# Altium schematic sheet STM32_microcontroller_IOs.SchDoc: STM32_microcontroller_IOs
size A3; Date: Not used; ApprovedBy: Not used; CheckedBy: Not used; Author: Not used; CompanyName: STMicroelectronics; DrawnBy: Not used; Engineer: Not used; Organization: Not used; Address1: Not used; Address2: Not used; Address3: Not used; Address4: Not used; DocumentNumber: 3; Revision: Not used; SheetNumber: 3; SheetTotal: 9; CurrentTime: Not used; CurrentDate: Not used; Time: Not used; DocumentFullPathAndName: Not used; DocumentName: Not used; ModifiedDate: Not used; ImagePath: Not used; ProjectName: Not used; Application_BuildNumber: Not used
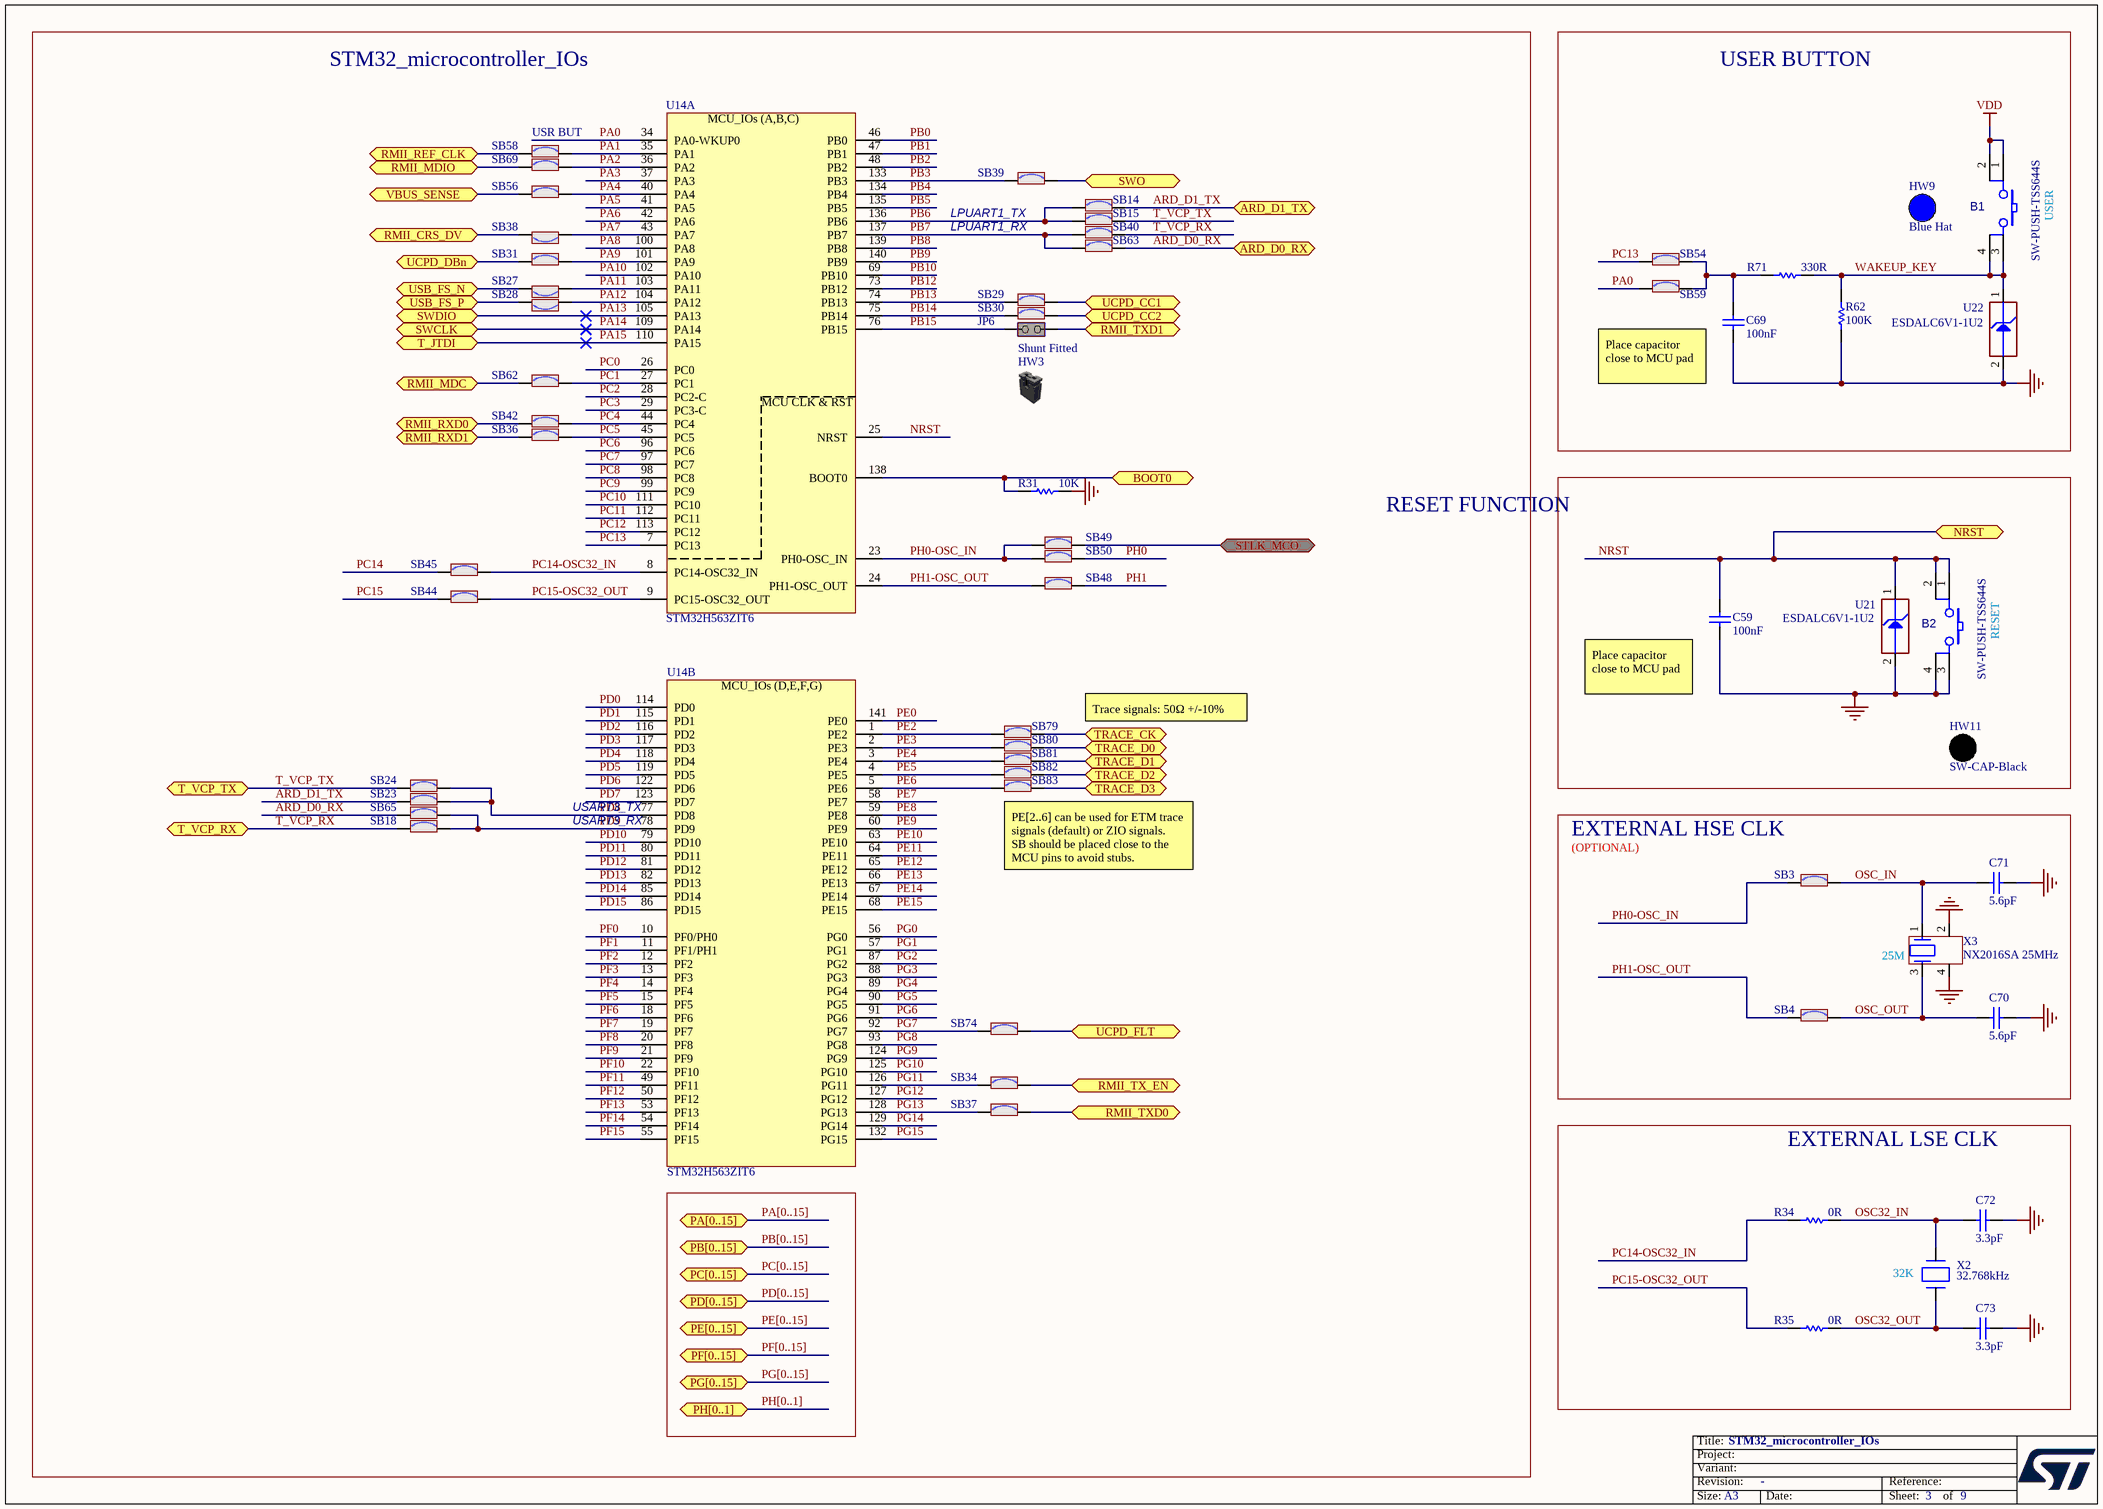
[diagram p0: STM32_microcontroller_IOs.SchDoc]

## Parts
B1  value SW-PUSH-TSS644S  [SWI_KNITTER_TSS644S]  (hidden comment: SW_PUSH_SMD)
B2  value SW-PUSH-TSS644S  [SWI_KNITTER_TSS644S]  (hidden comment: SW_PUSH_SMD)
C59  value 100nF  [C0603]  (hidden comment: Capacitor)
C69  value 100nF  [C0603]  (hidden comment: Capacitor)
C70  value 5.6pF  [C0402]  (hidden comment: Capacitor)
C71  value 5.6pF  [C0402]  (hidden comment: Capacitor)
C72  value 3.3pF  [C0402]  (hidden comment: Capacitor)
C73  value 3.3pF  [C0402]  (hidden comment: Capacitor)
HW3  Shunt Black 2.54mm  (value not drawn)  (mechanical)
HW9  value Blue Hat  (hidden comment: BUTTON_HAT_BLUE)  (mechanical)
HW11  SW-CAP-Black  (mechanical)
JP6  value Shunt Fitted  [CON_SAMTEC_TSW-102-07-G-S]  (hidden comment: Jumper_Header 2x1 Fitted)
R31  value 10K  [R0603]  (hidden comment: Resistor)
R34  value 0R  [R0603]  (hidden comment: Resistor)
R35  value 0R  [R0603]  (hidden comment: Resistor)
R62  value 100K  [R0603]  (hidden comment: Resistor)
R71  value 330R  [R0603]  (hidden comment: Resistor)
SB3  SB_ON  [SOLDER-BRIDGE_R0603-0R]  (value not drawn)
SB4  SB_ON  [SOLDER-BRIDGE_R0603-0R]  (value not drawn)
SB14  SB_ON  [SOLDER-BRIDGE_R0603-0R]  (value not drawn)
SB15  SB_ON  [SOLDER-BRIDGE_R0603-0R]  (value not drawn)
SB18  SB_ON  [SOLDER-BRIDGE_R0603-0R]  (value not drawn)
SB23  SB_ON  [SOLDER-BRIDGE_R0603-0R]  (value not drawn)
SB24  SB_ON  [SOLDER-BRIDGE_R0603-0R]  (value not drawn)
SB27  SB_ON  [SOLDER-BRIDGE_R0402-0R]  (value not drawn)
SB28  SB_ON  [SOLDER-BRIDGE_R0402-0R]  (value not drawn)
SB29  SB_ON  [SOLDER-BRIDGE_R0603-0R]  (value not drawn)
SB30  SB_ON  [SOLDER-BRIDGE_R0603-0R]  (value not drawn)
SB31  SB_ON  [SOLDER-BRIDGE_R0402-0R]  (value not drawn)
SB34  SB_ON  [SOLDER-BRIDGE_R0603-0R]  (value not drawn)
SB36  SB_ON  [SOLDER-BRIDGE_R0402-0R]  (value not drawn)
SB37  SB_ON  [SOLDER-BRIDGE_R0603-0R]  (value not drawn)
SB38  SB_ON  [SOLDER-BRIDGE_R0402-0R]  (value not drawn)
SB39  SB_ON  [SOLDER-BRIDGE_R0603-0R]  (value not drawn)
SB40  SB_ON  [SOLDER-BRIDGE_R0603-0R]  (value not drawn)
SB42  SB_ON  [SOLDER-BRIDGE_R0603-0R]  (value not drawn)
SB44  SB_ON  [SOLDER-BRIDGE_R0402-0R]  (value not drawn)
SB45  SB_ON  [SOLDER-BRIDGE_R0402-0R]  (value not drawn)
SB48  SB_ON  [SOLDER-BRIDGE_R0603-0R]  (value not drawn)
SB49  SB_ON  [SOLDER-BRIDGE_R0603-0R]  (value not drawn)
SB50  SB_ON  [SOLDER-BRIDGE_R0603-0R]  (value not drawn)
SB54  SB_ON  [SOLDER-BRIDGE_R0402-0R]  (value not drawn)
SB56  SB_ON  [SOLDER-BRIDGE_R0402-0R]  (value not drawn)
SB58  SB_ON  [SOLDER-BRIDGE_R0603-0R]  (value not drawn)
SB59  SB_ON  [SOLDER-BRIDGE_R0603-0R]  (value not drawn)
SB62  SB_ON  [SOLDER-BRIDGE_R0603-0R]  (value not drawn)
SB63  SB_ON  [SOLDER-BRIDGE_R0402-0R]  (value not drawn)
SB65  SB_ON  [SOLDER-BRIDGE_R0402-0R]  (value not drawn)
SB69  SB_ON  [SOLDER-BRIDGE_R0603-0R]  (value not drawn)
SB74  SB_ON  [SOLDER-BRIDGE_R0603-0R]  (value not drawn)
SB79  SB_ON  [SOLDER-BRIDGE_R0402-0R]  (value not drawn)
SB80  SB_ON  [SOLDER-BRIDGE_R0402-0R]  (value not drawn)
SB81  SB_ON  [SOLDER-BRIDGE_R0402-0R]  (value not drawn)
SB82  SB_ON  [SOLDER-BRIDGE_R0402-0R]  (value not drawn)
SB83  SB_ON  [SOLDER-BRIDGE_R0402-0R]  (value not drawn)
U14  STM32H563ZIT6  [ICC_LQFP144_20X20_P050_SOCKET_YAMAICHI_IC149-144-145-B5_NM]  (parts A,B of 3)
U21  value ESDALC6V1-1U2  [ESD_ST0201]  (hidden comment: ESD-TRANSIL)
U22  value ESDALC6V1-1U2  [ESD_ST0201]  (hidden comment: ESD-TRANSIL)
X2  value 32.768kHz  [CRY_NX1610SE_2P]  (hidden comment: XTAL_2_PINS)
X3  value NX2016SA 25MHz  [CRY_NX2016SA_4P]  (hidden comment: XTAL_4_PINS)

## Blocks framed on the sheet
STM32_microcontroller_IOs: HW3 JP6 R31 SB14 SB15 SB18 SB23 SB24 SB27-SB31 SB34 SB36-SB40 SB42 SB44 SB45 SB48-SB50 SB56 SB58 SB62 SB63 SB65 SB69 SB74 SB79-SB83 U14
USER BUTTON: B1 C69 HW9 R62 R71 SB54 SB59 U22
RESET FUNCTION: B2 C59 HW11 U21
EXTERNAL HSE CLK: C70 C71 SB3 SB4 X3
EXTERNAL LSE CLK: C72 C73 R34 R35 X2

## Ports
ARD_D0_RX (bidir), ARD_D1_TX (bidir), BOOT0 (bidir), NRST (bidir), PA[0..15] (bidir), PB[0..15] (bidir), PC[0..15] (bidir), PD[0..15] (bidir), PE[0..15] (bidir), PF[0..15] (bidir), PG[0..15] (bidir), PH[0..1] (bidir), RMII_CRS_DV (bidir), RMII_MDC (bidir), RMII_MDIO (bidir), RMII_REF_CLK (bidir), RMII_RXD0 (bidir), RMII_RXD1 (bidir), RMII_TX_EN (bidir), RMII_TXD0 (bidir), RMII_TXD1 (bidir), STLK_MCO (bidir), SWCLK (bidir), SWDIO (bidir), SWO (bidir), T_JTDI (bidir), T_VCP_RX (bidir), T_VCP_TX (bidir), TRACE_CK (bidir), TRACE_D0 (bidir), TRACE_D1 (bidir), TRACE_D2 (bidir), TRACE_D3 (bidir), UCPD_CC1 (bidir), UCPD_CC2 (bidir), UCPD_DBn (bidir), UCPD_FLT (bidir), USB_FS_N (bidir), USB_FS_P (bidir), VBUS_SENSE (bidir)

## Nets
GND: B2.3 B2.4 C59.1 C69.1 C70.2 C71.2 C72.2 C73.2 R31.2 R62.1 U21.2(GND) U22.2(GND) X3.2 X3.4
VDD: B1.1 B1.2
ARD_D0_RX: SB63.2 SB65.1 ; port ARD_D0_RX
ARD_D1_TX: SB14.1 SB23.2 ; port ARD_D1_TX
BOOT0: R31.1 U14.138(BOOT0) ; port BOOT0
NRST: B2.1 B2.2 C59.2 U14.25(NRST) U21.1(IO1) ; port NRST
OSC32_IN: C72.1 R34.2 X2.2(X2)
OSC32_OUT: C73.1 R35.2 X2.1(X1)
OSC_IN: C71.1 SB3.2 X3.1
OSC_OUT: C70.1 SB4.2 X3.3
PA0: SB59.2 U14.34(PA0-WKUP0)
PA1: SB58.1 U14.35(PA1)
PA2: SB69.1 U14.36(PA2)
PA3: U14.37(PA3)
PA4: SB56.2 U14.40(PA4)
PA5: U14.41(PA5)
PA6: U14.42(PA6)
PA7: SB38.1 U14.43(PA7)
PA8: U14.100(PA8)
PA9: SB31.2 U14.101(PA9)
PA10: U14.102(PA10)
PA11: SB27.1 U14.103(PA11)
PA12: SB28.1 U14.104(PA12)
PA13: U14.105(PA13) ; port SWDIO
PA14: U14.109(PA14) ; port SWCLK
PA15: U14.110(PA15) ; port T_JTDI
PB0: U14.46(PB0)
PB1: U14.47(PB1)
PB2: U14.48(PB2)
PB3: SB39.2 U14.133(PB3)
PB4: U14.134(PB4)
PB5: U14.135(PB5)
PB6: SB14.2 SB15.2 U14.136(PB6)
PB7: SB40.2 SB63.1 U14.137(PB7)
PB8: U14.139(PB8)
PB9: U14.140(PB9)
PB10: U14.69(PB10)
PB12: U14.73(PB12)
PB13: SB29.1 U14.74(PB13)
PB14: SB30.1 U14.75(PB14)
PB15: JP6.1(COMMON) U14.76(PB15)
PC0: U14.26(PC0)
PC1: SB62.2 U14.27(PC1)
PC2: U14.28(PC2-C)
PC3: U14.29(PC3-C)
PC4: SB42.2 U14.44(PC4)
PC5: SB36.2 U14.45(PC5)
PC6: U14.96(PC6)
PC7: U14.97(PC7)
PC8: U14.98(PC8)
PC9: U14.99(PC9)
PC10: U14.111(PC10)
PC11: U14.112(PC11)
PC12: U14.113(PC12)
PC13: SB54.1 U14.7(PC13)
PC14: SB45.1
PC14-OSC32_IN: R34.1 SB45.2 U14.8(PC14-OSC32_IN)
PC15: SB44.1
PC15-OSC32_OUT: R35.1 SB44.2 U14.9(PC15-OSC32_OUT)
PD0: U14.114(PD0)
PD1: U14.115(PD1)
PD2: U14.116(PD2)
PD3: U14.117(PD3)
PD4: U14.118(PD4)
PD5: U14.119(PD5)
PD6: U14.122(PD6)
PD7: U14.123(PD7)
PD8: SB23.1 SB24.1 U14.77(PD8)
PD9: SB18.1 SB65.2 U14.78(PD9)
PD10: U14.79(PD10)
PD11: U14.80(PD11)
PD12: U14.81(PD12)
PD13: U14.82(PD13)
PD14: U14.85(PD14)
PD15: U14.86(PD15)
PE0: U14.141(PE0)
PE2: SB79.1 U14.1(PE2)
PE3: SB80.1 U14.2(PE3)
PE4: SB81.1 U14.3(PE4)
PE5: SB82.1 U14.4(PE5)
PE6: SB83.1 U14.5(PE6)
PE7: U14.58(PE7)
PE8: U14.59(PE8)
PE9: U14.60(PE9)
PE10: U14.63(PE10)
PE11: U14.64(PE11)
PE12: U14.65(PE12)
PE13: U14.66(PE13)
PE14: U14.67(PE14)
PE15: U14.68(PE15)
PF0: U14.10(PF0/PH0)
PF1: U14.11(PF1/PH1)
PF2: U14.12(PF2)
PF3: U14.13(PF3)
PF4: U14.14(PF4)
PF5: U14.15(PF5)
PF6: U14.18(PF6)
PF7: U14.19(PF7)
PF8: U14.20(PF8)
PF9: U14.21(PF9)
PF10: U14.22(PF10)
PF11: U14.49(PF11)
PF12: U14.50(PF12)
PF13: U14.53(PF13)
PF14: U14.54(PF14)
PF15: U14.55(PF15)
PG0: U14.56(PG0)
PG1: U14.57(PG1)
PG2: U14.87(PG2)
PG3: U14.88(PG3)
PG4: U14.89(PG4)
PG5: U14.90(PG5)
PG6: U14.91(PG6)
PG7: SB74.2 U14.92(PG7)
PG8: U14.93(PG8)
PG9: U14.124(PG9)
PG10: U14.125(PG10)
PG11: SB34.2 U14.126(PG11)
PG12: U14.127(PG12)
PG13: SB37.2 U14.128(PG13)
PG14: U14.129(PG14)
PG15: U14.132(PG15)
PH0: SB50.2
PH0-OSC_IN: SB3.1 SB49.1 SB50.1 U14.23(PH0-OSC_IN)
PH1: SB48.2
PH1-OSC_OUT: SB4.1 SB48.1 U14.24(PH1-OSC_OUT)
RMII_CRS_DV: SB38.2 ; port RMII_CRS_DV
RMII_MDC: SB62.1 ; port RMII_MDC
RMII_MDIO: SB69.2 ; port RMII_MDIO
RMII_REF_CLK: SB58.2 ; port RMII_REF_CLK
RMII_RXD0: SB42.1 ; port RMII_RXD0
RMII_RXD1: SB36.1 ; port RMII_RXD1
RMII_TX_EN: SB34.1 ; port RMII_TX_EN
RMII_TXD0: SB37.1 ; port RMII_TXD0
RMII_TXD1: JP6.2(NO) ; port RMII_TXD1
STLK_MCO: SB49.2 ; port STLK_MCO
SWO: SB39.1 ; port SWO
T_VCP_RX: SB18.2 SB40.1 ; port T_VCP_RX
T_VCP_TX: SB15.1 SB24.2 ; port T_VCP_TX
TRACE_CK: SB79.2 ; port TRACE_CK
TRACE_D0: SB80.2 ; port TRACE_D0
TRACE_D1: SB81.2 ; port TRACE_D1
TRACE_D2: SB82.2 ; port TRACE_D2
TRACE_D3: SB83.2 ; port TRACE_D3
UCPD_CC1: SB29.2 ; port UCPD_CC1
UCPD_CC2: SB30.2 ; port UCPD_CC2
UCPD_DBn: SB31.1 ; port UCPD_DBn
UCPD_FLT: SB74.1 ; port UCPD_FLT
USB_FS_N: SB27.2 ; port USB_FS_N
USB_FS_P: SB28.2 ; port USB_FS_P
VBUS_SENSE: SB56.1 ; port VBUS_SENSE
WAKEUP_KEY: B1.3 B1.4 R62.2 R71.2 U22.1(IO1)
NetC69_2: C69.2 R71.1 SB54.2 SB59.1

## Buses and harness runs
bus PA[0..15] = port PA[0..15]
bus PB[0..15] = port PB[0..15]
bus PC[0..15] = port PC[0..15]
bus PD[0..15] = port PD[0..15]
bus PE[0..15] = port PE[0..15]
bus PF[0..15] = port PF[0..15]
bus PG[0..15] = port PG[0..15]
bus PH[0..1] = port PH[0..1]

## Notes on the sheet
- (near SB58) USR BUT
- (near SB39) LPUART1_TX
- (near SB39) LPUART1_RX
- (near B1) USER
- Place capacitor close to MCU pad
- (near B2) RESET
- Trace signals: 50Ω +/-10%
- (near C59) Place capacitor close to MCU pad
- USART3_TX
- USART3_RX
- (OPTIONAL)
- (near SB83) PE[2..6] can be used for ETM trace signals (default) or ZIO signals.
  SB should be placed close to the MCU pins to avoid stubs.
- (near X3) 25M
- (near X2) 32K
- Title:
- Project:
- Size:
- Revision:
- Variant:
- A3
- -
- Date:
- Reference:
- Sheet:
- of
- (in symbol MCD-02359, part A) MCU_IOs (A,B,C); MCU CLK & RST
- (in symbol MCD-02359, part B) MCU_IOs (D,E,F,G)

## Library data of the parts
B1 B2 = MCD-02417: Push Button, NO, 0.05A, 12V, 2.6N, SMD, 9.0x6.2mm, T=7.3mm, changeable caps KTSC-6xx; Part_Type: Misc; Part_Preference: Recommended; Manufacturer: KNITTER-SWITCH; Manufacturer_Part_Number: TSS644S; Internal_Part_Number: MCD-02417; Status: Checked; Alternate_Manufacturer: N/A; Alternate_Manufacturer_Part_Number: N/A; Package: 9.0x6.2mm; ComponentLink1URL: http://tunmcdsvn.tun.st.com/Component_Documentation_Library/Trunk/Misc/KNITTER_TSS6x_Series; Order_Code_Digikey: N/A; Order_Code_Farnell: N/A; Order_Code_RS: N/A
C59 C69 = MCD-02119: Capacitor, MLCC, 100nF, 6V3, X5R, +/-10%, 0603, T=0.8mm; Part_Preference: Recommended; Manufacturer: KEMET; Manufacturer_Part_Number: C0603C104K9PACTU; Component_Country_Of_Origin: Mexico; ShowFields: YES; ID: 4219; Internal_Part_Number: MCD-02119; Status: Checked; Part_Type: Capacitor; Package: 0603; ComponentLink1URL: http://tunmcdsvn.tun.st.com/Component_Documentation_Library/Trunk/Capacitor/KEMET_X5R_Series/C0603C104K9PACTU; Order_Code_Digikey: N/A; Order_Code_Farnell: 2941311; Order_Code_RS: N/A
C70 C71 = MCD-01374: Capacitor, MLCC, 5.6pF, 50V, NPO, 5%, 0402, T=0,5mm; Manufacturer_Part_Number: CC0402BRNPO9BN5R6; Manufacturer: YAGEO; Provided_By: SUBCO; Internal_Part_Number: MCD-01374; Status: Released; Part_Type: Capacitor; Package: C0402; ComponentLink1Description: Datasheet; ComponentLink1URL: http://tunmcdsvn.tun.st.com/Component_Datasheet_Library/Trunk/Capacitors/Yageo_Capacitor_NP0_16V-to-50V; ECCN_US: N/A; ECCN_EU: N/A
C72 C73 = MCD-01775: Capacitor, MLCC, 3.3pF, 50V, NPO, +/-0.1pF, 0402, T=0.5mm; Part_Preference: Recommended; Manufacturer: YAGEO; Manufacturer_Part_Number: CC0402BRNPO9BN3R3; Component_Country_Of_Origin: China; ShowFields: YES; ID: 3875; Internal_Part_Number: MCD-01775; Status: Released; Part_Type: Capacitor; Package: 0402; ComponentLink1URL: http://tunmcdsvn.tun.st.com/Component_Documentation_Library/Trunk/Capacitor/YAGEO_NP0_Series; Order_Code_Digikey: 311-1621-1-ND; Order_Code_Farnell: N/A; Order_Code_RS: N/A
HW3 = MCD-00043: SHUNT 2.54mm BLACK; Manufacturer_Part_Number: SNT-100-BK-G; Manufacturer: SAMTEC; Part_Type: Mechanical; Alternate_Manufacturer_Part_Number: 316102S111A; Alternate_Manufacturer: JIUBABA; Provided_By: SUBCO; Value: SNT-100-BK-G; Internal_Part_Number: MCD-00043; ComponentLink1Description: Datasheet; Status: Released; ComponentLink1URL: http://tunmcdsvn.tun.st.com/Component_Datasheet_Library/Trunk/Connectors/Samtec_Shunt_Jumper_SNT100; ECCN_US: n/a; ECCN_EU: n/a
HW9 = MCD-02136: Switch hat, blue, For KTSC-62B; Part_Type: Misc; Part_Preference: Recommended; Manufacturer: APEM INC; Manufacturer_Part_Number: AKTSC62B; Order_Code_RS: 378-6779; Component_Country_Of_Origin: Unknown; ShowFields: YES; ID: 4236; Internal_Part_Number: MCD-02136; Status: Checked; ComponentLink1URL: http://tunmcdsvn.tun.st.com/Component_Datasheet_Library/Trunk/Mechanical/APEM_BLUEHAT_KTSC62; Order_Code_Digikey: AKTSC62B-ND; Order_Code_Farnell: N/A
HW11 = MCD-02420: Black round cap for TSS6x series; Part_Type: Mechanical; Part_Preference: Recommended; Manufacturer: KNITTER-SWITCH; Manufacturer_Part_Number: KTSC-62K; Value: SW-CAP-KTSC-62K; Order_code_Digikey: N/A; Order_code_Farnell: N/A; Order_code_RS: N/A; Status: Checked; ComponentLink1URL: http://tunmcdsvn.tun.st.com/Component_Documentation_Library/Trunk/Mechanical/KNITTER_KTSC-62_Series; Internal_Part_Number: MCD-02420; Alternate_Manufacturer: N/A; Alternate_Manufacturer_Part_Number: N/A
JP6 = MCD-00683: Header, 2x1, 2,54mm, VR, TH, Height 5.84mm/2.54mm - Shunt Fitted by default; Part_Type: Connector; Manufacturer_Part_Number: TSW-102-07-x-S; Manufacturer: SAMTEC; Alternate_Manufacturer_Part_Number: 313102S111116; Alternate_Manufacturer: LIANYI; Provided_By: SUBCO; Internal_Part_Number: MCD-00683; Status: Released; ComponentLink1Description: Datasheet; ComponentLink1URL: http://tunmcdsvn.tun.st.com/Component_Datasheet_Library/Trunk/Connectors/Samtec_TSW-HTSW-series; ECCN_US: n/a; ECCN_EU: n/a
R31 = MCD-00220: Resistor,10K,0603,1%,1/10W; Manufacturer_Part_Number: RC0603FR-0710KL; Manufacturer: YAGEO; Provided_By: SUBCO; ECCN_US: EAR99; ECCN_EU: NEC; Internal_Part_Number: MCD-00220; Status: Released; Part_Type: Resistor; ComponentLink1Description: Datasheet; Package: R0603; ComponentLink1URL: http://tunmcdsvn.tun.st.com/Component_Datasheet_Library/Trunk/Resistors/Yageo_Resistor_RC0603-series
R34 R35 = MCD-00056: Resistor,0R,0603,5%,1/10W; Manufacturer_Part_Number: RC0603JR-070RL; Manufacturer: YAGEO; Provided_By: SUBCO; ECCN_US: EAR99; ECCN_EU: NEC; Internal_Part_Number: MCD-00056; ComponentLink1Description: Datasheet; Status: Released; Part_Type: Resistor; Package: R0603; ComponentLink1URL: http://tunmcdsvn.tun.st.com/Component_Datasheet_Library/Trunk/Resistors/Yageo_Resistor_RC0603-series
R62 = MCD-00223: Resistor,100K,0603,1%,1/10W; Manufacturer_Part_Number: RC0603FR-07100KL; Manufacturer: YAGEO; Provided_By: SUBCO; ECCN_US: EAR99; ECCN_EU: NEC; Internal_Part_Number: MCD-00223; ComponentLink1Description: Datasheet; Status: Released; Part_Type: Resistor; Package: R0603; ComponentLink1URL: http://tunmcdsvn.tun.st.com/Component_Datasheet_Library/Trunk/Resistors/Yageo_Resistor_RC0603-series
R71 = MCD-00197: Resistor,330R,0603,1%,1/10W; Manufacturer_Part_Number: RC0603FR-07330RL; Manufacturer: YAGEO; BMS_Part_Number: 9129729; Provided_By: SUBCO; ECCN_US: EAR99; ECCN_EU: NEC; Internal_Part_Number: MCD-00197; Status: Released; Part_Type: Resistor; Package: R0603; ComponentLink1Description: Datasheet; ComponentLink1URL: http://tunmcdsvn.tun.st.com/Component_Datasheet_Library/Trunk/Resistors/Yageo_Resistor_RC0603-series
SB3 SB4 SB14 SB15 SB18 SB23 SB24 SB29 SB30 SB34 SB37 SB39 SB40 SB42 SB48-SB50 SB58 SB59 SB62 SB69 SB74 = MCD-00071: Solder Bridge ON; Part_Type: Mechanical; Manufacturer_Part_Number: RC0603JR-070RL; Manufacturer: YAGEO; Provided_By: SUBCO; Internal_Part_Number: MCD-00071; Status: Released; ComponentLink1Description: Datasheet; Package: SB0603; ComponentLink1URL: http://tunmcdsvn.tun.st.com/Component_Datasheet_Library/Trunk/Resistors/Yageo_Resistor_RC0603-series; ECCN_US: n/a; ECCN_EU: n/a
SB27 SB28 SB31 SB36 SB38 SB44 SB45 SB54 SB56 SB63 SB65 SB79-SB83 = MCD-01618: Solder Bridge 0402 ON; Part_Type: Mechanical; Manufacturer_Part_Number: RC0402JR-070RL; Manufacturer: YAGEO; Provided_By: SUBCO; Internal_Part_Number: MCD-01618; Status: Footprint available; Package: SB0402; ComponentLink1Description: Datasheet; ComponentLink1URL: http://tunmcdsvn.tun.st.com/Component_Datasheet_Library/Trunk/Resistors/Yageo_Resistor_RC0402-series; ECCN_US: n/a; ECCN_EU: n/a
U14 = MCD-02359: STM32H563ZIT6, LQFP144 package, 20x20; Part_Type: IC; Manufacturer: STMICROELECTRONICS; Part_Preference: Recommended; Internal_Part_Number: MCD-02359; Status: New; Manufacturer_Part_Number: STM32H563ZIT6; Package: LQFP144; ComponentLink1Description: Datasheet; ComponentLink1URL: http://tunmcdsvn.tun.st.com/Component_Datasheet_Library/Trunk/IC/STM_STM32L552ZET6QU; Value: STM32H563ZIT6
U21 U22 = MCD-00170: ESD protection 6V1; Part_Type: Diode; Manufacturer: STMICROELECTRONICS; BMS_Part_Number: 9151132; Provided_By: SUBCO with ST control; ECCN_US: EAR99; ECCN_EU: NEC; Internal_Part_Number: MCD-00170; Status: Released; Manufacturer_Part_Number: ESDALC6V1-1U2; ComponentLink1Description: Datasheet; ComponentLink1URL: http://tunmcdsvn.tun.st.com/Component_Datasheet_Library/Trunk/Diodes/STM_ESD_ESDALC6V1-1U2
X2 = MCD-02291: Crystal, 32.768kHz, 9pF, +/-20ppm, 70KR, 1.6x1mm; Part_Type: Crystal_Osc; Part_Preference: Recommended; Manufacturer: NDK; Manufacturer_Part_Number: NX1610SE-32.768KHZ-EXS00A-MU01499; Component_Country_Of_Origin: Unknown; ShowFields: YES; ID: 4391; Internal_Part_Number: MCD-02291; Status: Released; Package: 1.6x1mm; ComponentLink1URL: http://tunmcdsvn.tun.st.com/Component_Datasheet_Library/Trunk/Crystal_Osc/NDK_NX1610SE 32.768KHz EXS00A-MU01499; Order_Code_Digikey: N/A; Order_Code_Farnell: N/A; Order_Code_RS: N/A
X3 = MCD-01364: Crystal 25MHz, 6pF, +-20ppm, 80ohms max, SMD; Part_Type: Crystal_Osc; Manufacturer_Part_Number: NX2016SA 25MHz EXS00A-CS11321; Manufacturer: NDK; BMS_Part_Number: 9157044; Provided_By: SUBCO; ECCN_US: EAR99; ECCN_EU: NEC; Internal_Part_Number: MCD-01364; Status: Released; Package: NX2016SA; ComponentLink1Description: Datasheet; ComponentLink1URL: http://tunmcdsvn.tun.st.com/Component_Datasheet_Library/Trunk/Crystal_Osc/NDK_NX2016SA 25MHz EXS00A-CS11321 (EXS10B-28187); Order_Code_Digikey: 644-1367